# Altium schematic sheet RECOM_R-78C15-1.0_1A_42V_to_15V.SchDoc
size A4; CompanyName: Technische Hochschule Nürnberg Georg Simon Ohm; Address1: Fürther Straße 250; Address2: 90429 Nürnberg; Address3: GERMANY; SheetNumber: 16; SheetTotal: 17; CompanyName2: Institut ELSYS
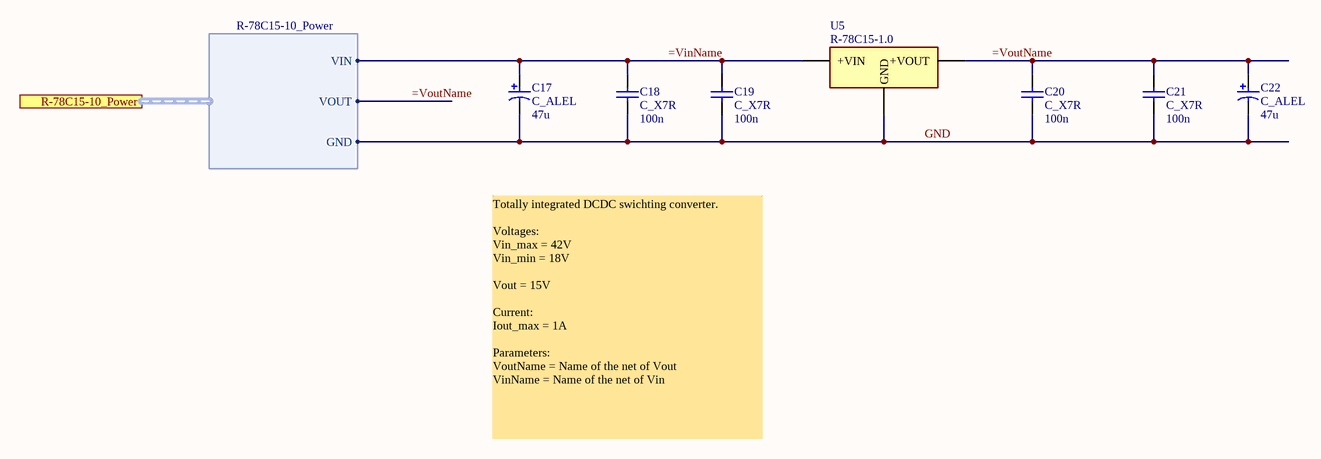
[diagram p0: RECOM_R-78C15-1.0_1A_42V_to_15V.SchDoc]

## Parts
C17  C_ALEL  value 47u  [CAPAE9583X66L]
C18  C_X7R  value 100n  [CAPC3216X180X50NL20T25]
C19  C_X7R  value 100n  [CAPC3216X180X50NL20T25]
C20  C_X7R  value 100n  [CAPC3216X180X50NL20T25]
C21  C_X7R  value 100n  [CAPC3216X180X50NL20T25]
C22  C_ALEL  value 47u  [CAPAE9583X66L]
U5  R-78C15-1.0  [R78C1510]

## Ports
R-78C15-10_Power (harness R-78C15-10_Power)

## Harnesses
R-78C15-10_Power: VIN, VOUT, GND

## Nets
=VinName: C17.1 C18.2 C19.2 U5.1(+VIN) ; port R-78C15-10_Power.VIN
=VoutName: C20.2 C21.2 C22.1 U5.3(+VOUT) ; port R-78C15-10_Power.VOUT
GND: C17.2 C18.1 C19.1 C20.1 C21.1 C22.2 U5.2(GND) ; port R-78C15-10_Power.GND

## Notes on the sheet
- Totally integrated DCDC swichting converter.
  Voltages:
  Vin_max = 42V
  Vin_min = 18V
  Vout = 15V
  Current:
  Iout_max = 1A
  Parameters:
  VoutName = Name of the net of Vout
  VinName = Name of the net of Vin
- Title
- Size:
- Date:
- A4
- Revision:
- Time:
- Sheet
- of
- Author:
- Project:

## Library data of the parts
C17 C22 = C_ALEL_47u: Standard Aluminium electrolyt capacitor.; MPN: EEE1VA470P; MaxVoltage: 35; MF: Panasonic; Created: 2019-12-13_Thilo_Wendt; Package: CAPAE9583X66L; HelpURL: https://industrial.panasonic.com/cdbs/www-data/pdf/RDE0000/ABA0000C1145.pdf; ComponentLink1Description: Datasheet; ComponentLink1URL: https://industrial.panasonic.com/cdbs/www-data/pdf/RDE0000/ABA0000C1145.pdf; Supplier 1: Farnell; Supplier Part Number 1: 2326181; Supplier 2: Mouser; Supplier Part Number 2: 667-EEE-1VA470P
C18-C21 = C_X7R_SMALL: Standard X7R SMD capacitor. This kind of dielectricum should be used for decoupling applications. Bigger capacity is available but not for the given voltage rating.; MPN: C1206C104J5RACTU; Parameter1: 5; Parameter1Desc: Voltage Symbol; Parameter2: J; Parameter2Desc: Tolerance Symbol; MaxVoltage: 100; MinCap: 10p; MF: KEMET; Created: 2019-12-08_Thilo_Wendt; Package: CAPC3216X180X50NL20T25; HelpURL: https://content.kemet.com/datasheets/KEM_C1002_X7R_SMD.pdf; MaxCap: 100n; ComponentLink1Description: Datasheet; ComponentLink1URL: https://content.kemet.com/datasheets/KEM_C1002_X7R_SMD.pdf; Supplier 1: Farnell; Supplier Link 1: https://de.farnell.com/w/c/passive-bauelemente/kondensatoren/keramikkondensatoren/keramik-vielschichtkondensatoren-mlcc-smd?brand=kemet&kapazitatstoleranz=posneg-10pc&dielektrikum=x7r; Supplier 2: Mouser; Supplier Part Number 2: 80-C1206C104J5RACTU
U5 = R-78C15-1.0: Swichting Regulator Power Supply with integrated inductor.; MF: RECOM Power; MinVoltage: 18; MaxVoltage: 42; OutputVoltage: 15; HelpURL: https://www.recom-power.com/pdf/Innoline/R-78Cxx-1.0.pdf; MPN: R-78C15-1.0; Created: 2019-12-11_Thilo_Wendt; Value: R-78C15-1.0; Package: R78C1510; ComponentLink1Description: Datasheet; ComponentLink1URL: https://www.recom-power.com/pdf/Innoline/R-78Cxx-1.0.pdf